# EAGLE design channelswitcher_unify (EAGLE 7.3.0)
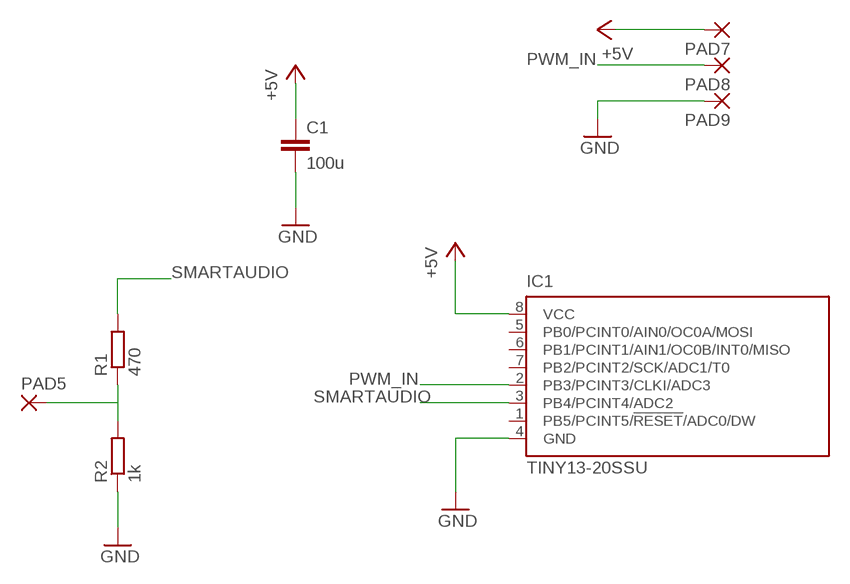
[diagram p0: schematic, sheet 1]

## Parts
C1  100u  C-EUC0805  [C0805]
IC1  TINY13-20SSU  [8S1]
PAD5  SMD2  [SMD1,27-2,54]
PAD7  SMD2  [SMD1,27-2,54]
PAD8  SMD2  [SMD1,27-2,54]
PAD9  SMD2  [SMD1,27-2,54]
R1  470  R-EU_R0805  [R0805]
R2  1k  R-EU_R0805  [R0805]

## Nets
+5V: C1.1 IC1.8(VCC) PAD7.1(P)
GND: C1.2 IC1.4(GND) PAD9.1(P) R2.1
N$2: PAD5.1(P) R1.1 R2.2
PWM_IN: IC1.2(PB3/PCINT3/CLKI/ADC3) PAD8.1(P)
SMARTAUDIO: IC1.3(PB4/PCINT4/ADC2) R1.2
Unconnected: IC1.1(PB5/PCINT5/!RESET!/ADC0/DW) IC1.5(PB0/PCINT0/AIN0/OC0A/MOSI) IC1.6(PB1/PCINT1/AIN1/OC0B/INT0/MISO) IC1.7(PB2/PCINT2/SCK/ADC1/T0)

## Library data of the parts
C1 = rcl:C-EU: CAPACITOR, European symbol
IC1 = atmel:TINY13: 8-bit AVR Microcontroller with 1K Bytes In-System Programmable Flash Source: http://www.atmel.com/dyn/resources/prod_documents/2535S.pdf; MPN: ATTINY13-20SSU; OC_FARNELL: 1455133; OC_NEWARK: 58M3771
PAD5 PAD7-PAD9 = wirepad:SMD2: SMD PAD
R1 R2 = rcl:R-EU_: RESISTOR, European symbol

## Board
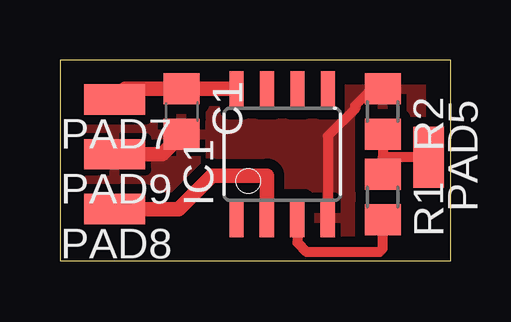
[diagram p1: board, top side]

Size 16.31 x 8.37 mm. Coordinates in mm from the lower left corner, seen from the top.
Outline: 0,0 16.31,0 16.31,8.37 0,8.37 0,0
Copper layers (1*16): Top 0.035mm / dielectric 1.5mm / Bottom 0.035mm
Design rules "default": minimum track width 10mil, minimum drill 24mil, track to track 8mil, track to pad 8mil, pad to pad 8mil, via to via 8mil, smd to smd 8mil, copper to edge 40mil, drill to drill 8mil, minimum pad ring 10mil, minimum via ring 8mil, stop-mask expansion 4mil, vias tented up to drill 0mil, thermal gap 10mil

### Footprints (pad centres in the part's own frame; a part is rotated, then mirrored left to right if it is on the bottom)
C0805 = smd 1.3 x 1.5: 1 -0.95,0; 2 0.95,0
8S1 = smd 0.6 x 1.6: 1 -1.905,-2.654; 2 -0.645,-2.654; 3 0.625,-2.654; 4 1.895,-2.654; 5 1.905,2.654; 6 0.635,2.654; 7 -0.635,2.654; 8 -1.905,2.654
SMD1,27-2,54 = smd 1.27 x 2.54: 1 0,0
R0805 = smd 1.3 x 1.5: 1 -0.95,0; 2 0.95,0

### Placement (x,y rotation side)
C1  5.08,6.22 270 top
IC1  9.27,4.45 0 top
PAD5  15.37,4.32 180 top
PAD7  2.29,6.73 90 top
PAD8  2.29,2.16 90 top
PAD9  2.29,4.45 90 top
R1  13.46,2.67 270 top
R2  13.46,6.22 270 top

### Tracks (layer width: path | path; a pad name or v marks a point on that pad's centre or on a via)
+5V
  Top 0.61: PAD7.1 2.73,7.17 C1.1 7.29,7.17 IC1.8
GND
  Top 0.406: R2.1 13.02,7.17 12.32,6.48 12.32,6.35 11.18,5.21 11.18,1.8 IC1.4
  Top 0.61: PAD9.1 4.25,4.45 C1.2
  pour Top (isolate 0.406): -0.89,9.65 15.24,9.65 15.24,-0.51 -0.89,-0.51
N$2
  Top 0.406: R2.2 13.46,4.32 | 13.46,4.32 R1.1 | PAD5.1 13.46,4.32
PWM_IN
  Top 0.61: PAD8.1 4.95,2.16 6.35,3.56 8.64,3.56 8.63,3.55 IC1.2
SMARTAUDIO
  Top 0.406: IC1.3 9.9,0.77 10.29,0.38 13.33,0.38 13.46,0.51 R1.2